# Altium schematic sheet 02_STEPPERS.SchDoc
size A4; SheetNumber: 3; SheetTotal: 3
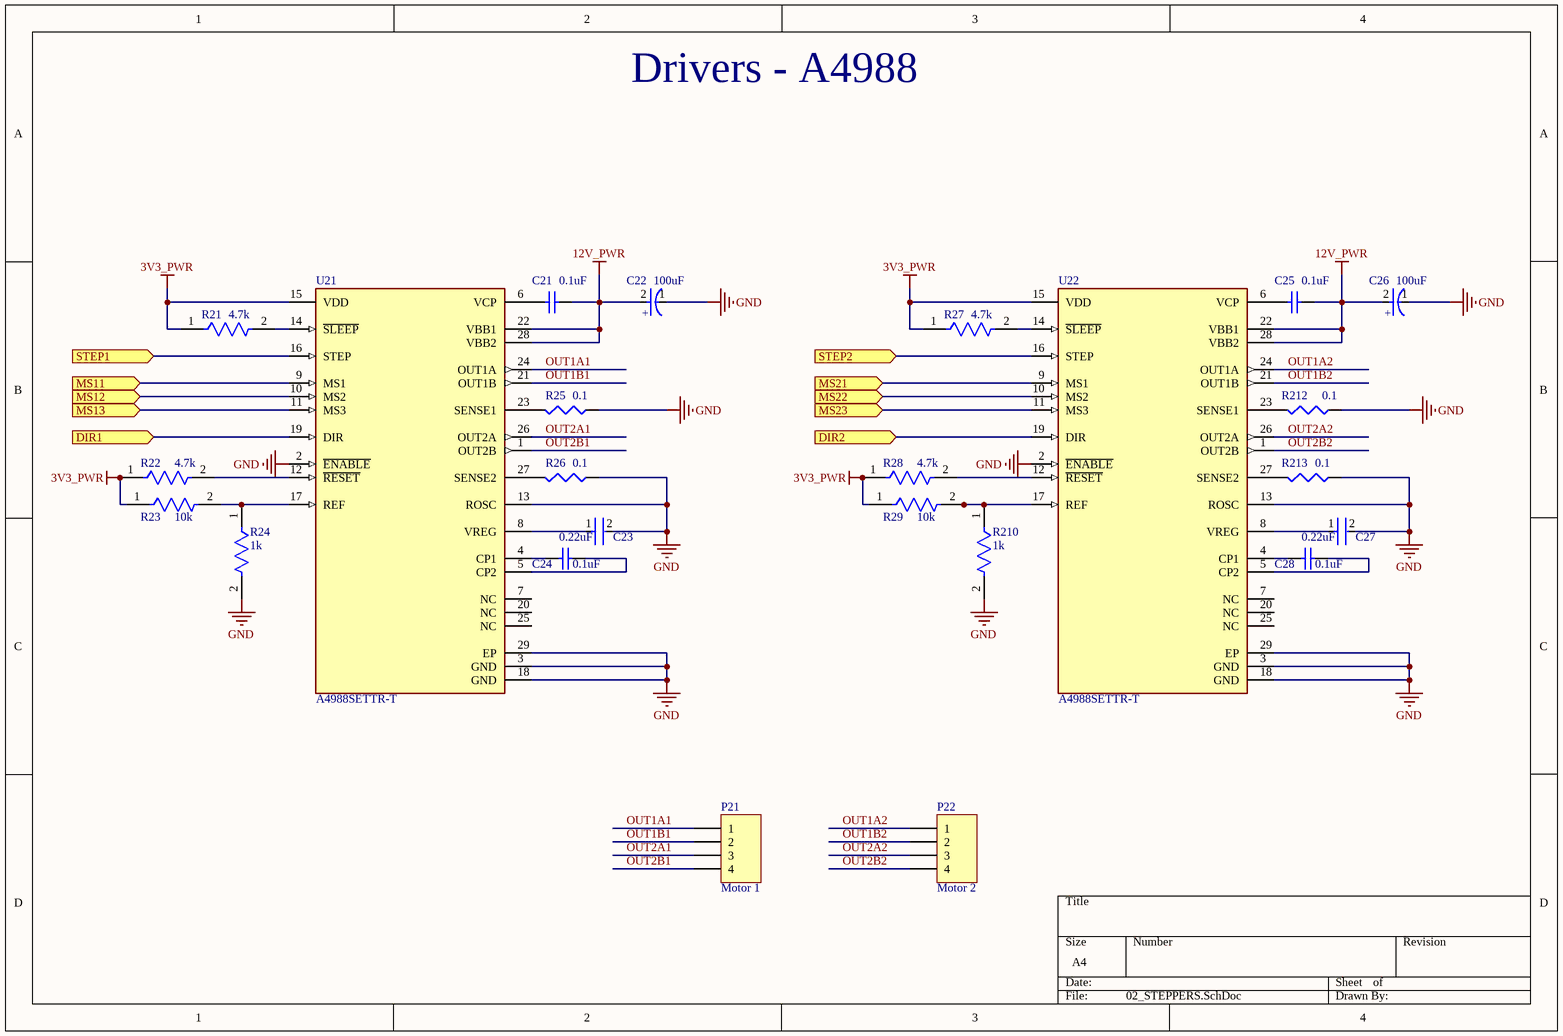
[diagram p0: 02_STEPPERS.SchDoc]

## Parts
C21  0.1uF  [CAPC1608X90X35ML15T15]
C22  100uF  [FP-MAL2150-1010-MFG]
C23  0.22uF  [FP-GCM188-0_1-IPC_B]
C24  0.1uF  [CAPC1608X90X35ML15T15]
C25  0.1uF  [CAPC1608X90X35ML15T15]
C26  100uF  [FP-MAL2150-1010-MFG]
C27  0.22uF  [FP-GCM188-0_1-IPC_B]
C28  0.1uF  [CAPC1608X90X35ML15T15]
P21  Motor 1  [HDR1X4]
P22  Motor 2  [HDR1X4]
R21  4.7k  [FP-MCT0603-IPC_B]
R22  4.7k  [FP-MCT0603-IPC_B]
R23  10k  [FP-AC0603-MFG]
R24  1k  [FP-RC0603-0_55-IPC_C]
R25  value 0.1  [J1-0603]  (hidden comment: Res3)
R26  value 0.1  [J1-0603]  (hidden comment: Res3)
R27  4.7k  [FP-MCT0603-IPC_B]
R28  4.7k  [FP-MCT0603-IPC_B]
R29  10k  [FP-AC0603-MFG]
R210  1k  [FP-RC0603-0_55-IPC_C]
R212  value 0.1  [J1-0603]  (hidden comment: Res3)
R213  value 0.1  [J1-0603]  (hidden comment: Res3)
U21  A4988SETTR-T  [FP-ET-28-MFG]
U22  A4988SETTR-T  [FP-ET-28-MFG]

## Ports
DIR1 (in, see GENERAL_DIAGRAMS[3B], 01_MAIN[1C]), DIR2 (in, see GENERAL_DIAGRAMS[3B], 01_MAIN[1C]), MS11 (in, see GENERAL_DIAGRAMS[3B], 01_MAIN[1C]), MS12 (in, see GENERAL_DIAGRAMS[3B], 01_MAIN[1C]), MS13 (in, see GENERAL_DIAGRAMS[3B], 01_MAIN[1C]), MS21 (in, see GENERAL_DIAGRAMS[3B], 01_MAIN[1C]), MS22 (in, see GENERAL_DIAGRAMS[3B], 01_MAIN[1C]), MS23 (in, see GENERAL_DIAGRAMS[3C], 01_MAIN[1C]), STEP1 (in, see GENERAL_DIAGRAMS[3B], 01_MAIN[1C]), STEP2 (in, see GENERAL_DIAGRAMS[3B], 01_MAIN[1C])

## Nets
3V3_PWR: R21.1 R22.1 R23.1 R27.1 R28.1 R29.1 U21.15(VDD) U22.15(VDD)
12V_PWR: C21.2 C22.2(A) C25.2 C26.2(A) U21.22(VBB1) U21.28(VBB2) U22.22(VBB1) U22.28(VBB2)
GND: C22.1(C) C23.2 C26.1(C) C27.2 R24.2 R25.1 R26.1 R210.2 R212.1 R213.1 U21.2(~{ENABLE}) U21.3(GND) U21.13(ROSC) U21.18(GND) U21.29(EP) U22.2(~{ENABLE}) U22.3(GND) U22.13(ROSC) U22.18(GND) U22.29(EP)
DIR1: U21.19(DIR) ; port DIR1
DIR2: U22.19(DIR) ; port DIR2
MS11: U21.9(MS1) ; port MS11
MS12: U21.10(MS2) ; port MS12
MS13: U21.11(MS3) ; port MS13
MS21: U22.9(MS1) ; port MS21
MS22: U22.10(MS2) ; port MS22
MS23: U22.11(MS3) ; port MS23
OUT1A1: P21.1 U21.24(OUT1A)
OUT1A2: P22.1 U22.24(OUT1A)
OUT1B1: P21.2 U21.21(OUT1B)
OUT1B2: P22.2 U22.21(OUT1B)
OUT2A1: P21.3 U21.26(OUT2A)
OUT2A2: P22.3 U22.26(OUT2A)
OUT2B1: P21.4 U21.1(OUT2B)
OUT2B2: P22.4 U22.1(OUT2B)
STEP1: U21.16(STEP) ; port STEP1
STEP2: U22.16(STEP) ; port STEP2
NetC21_1: C21.1 U21.6(VCP)
NetC23_1: C23.1 U21.8(VREG)
NetC24_1: C24.1 U21.5(CP2)
NetC24_2: C24.2 U21.4(CP1)
NetC25_1: C25.1 U22.6(VCP)
NetC27_1: C27.1 U22.8(VREG)
NetC28_1: C28.1 U22.5(CP2)
NetC28_2: C28.2 U22.4(CP1)
NetR21_2: R21.2 U21.14(~{SLEEP})
NetR22_2: R22.2 U21.12(~{RESET})
NetR23_2: R23.2 R24.1 U21.17(REF)
NetR25_2: R25.2 U21.23(SENSE1)
NetR26_2: R26.2 U21.27(SENSE2)
NetR27_2: R27.2 U22.14(~{SLEEP})
NetR28_2: R28.2 U22.12(~{RESET})
NetR29_2: R29.2 R210.1 U22.17(REF)
NetR212_2: R212.2 U22.23(SENSE1)
NetR213_2: R213.2 U22.27(SENSE2)

Not connected (* = marked no-connect by the designer): U21 7(NC) 20(NC) 25(NC); U22 7(NC) 20(NC) 25(NC)

## Notes on the sheet
- Drivers - A4988
- (in symbol CMP-02412-000026-1) +

## Library data of the parts
C21 C24 C25 C28 = CMP-2006-02075-1: Part Number: 06033C104KAT4A; Manufacturer: AVX Interconnect / Elco; Value: 100nF; Tolerance: 10%; Dielectric: X7R; Voltage Rating: 25V; Supplier: Digi-Key; Supplier Part Number: 478-7018-1-ND; Manufacturer Part Number: 06033C104KAT4A; RoHS: Yes; Category: Ceramic Capacitors; Stock: 1374924; Pricing: 1=0,1, 10=0,039, 50=0,0212, 100=0,0173, 500=0,01238, 1000=0,00972, 2500=0,00884, 5000=0,00813 (USD); Mounting Technology: Surface Mount; Case/Package: 0603; Pins: 2; Case Code (Metric): 1608; Case Code (Imperial): 0603; Min Operating Temperature: -55°C; Max Operating Temperature: 125°C; Packaging: Cut Tape; Series: -; Length: 1.6mm; Depth: 0.81mm; Reach SVHC Compliant: No; Lead Free: Lead Free; RoHS Compliant: Yes; ComponentLink1URL: https://datasheet.ciiva.com/22619/1679506-22619862.pdf?src-supplier=Element14; ComponentLink1Description: https://datasheet.ciiva.com/22619/1679506-22619862.pdf?src-supplier=Element14; ComponentLink2URL: https://datasheet.ciiva.com/28613/1679506-28613035.pdf?src-supplier=Element14; ComponentLink2Description: https://datasheet.ciiva.com/28613/1679506-28613035.pdf?src-supplier=Element14; ComponentLink3URL: https://datasheet.ciiva.com/6277/cx7r-6277758.pdf?src-supplier=Digi-Key; ComponentLink3Description: https://datasheet.ciiva.com/6277/cx7r-6277758.pdf?src-supplier=Digi-Key; ComponentLink4URL: https://datasheet.ciiva.com/6277/cx7r-6277759.pdf?src-supplier=Digi-Key; ComponentLink4Description: https://datasheet.ciiva.com/6277/cx7r-6277759.pdf?src-supplier=Digi-Key
C22 C26 = CMP-02412-000026-1: CAP ALUM 100UF 20% 50V SMD; Manufacturer: Vishay BCcomponents; Manufacturer Part Number: MAL215097101E3; Impedance: 240mR; Dissipation Factor: 0.12%; Ripple Current (AC): 490mA; Dielectric Material: Aluminium; Life (Hours): 3000Hour; Voltage Rating (DC): 50V; Capacitance: 100uF; Voltage Rating: 50V; Max Operating Temperature: 105°C; Width: 10mm; Construction: Cylindrical; ESR (Equivalent Series Resistance): 240mR; Radiation Hardening: No; Length: 10mm; Case/Package: Radial; Packaging: Tape and Reel; Min Operating Temperature: -55°C; Package Quantity: 500; RoHS Compliant: Yes; Series: Automotive, AEC-Q200, 150 CRZ; Ripple Current: 490mA; Height: 10mm; Tolerance: 20%; Diameter: 10mm; Termination: SMD/SMT; Supplier: Digi-Key; Supplier Part Number: BC5165CT-ND; RoHS: Yes; Category: Aluminum Electrolytic Capacitors; Stock: 6366; Pricing: 1=2,21, 10=1,787, 50=1,5594, 100=1,3645 (USD); Value: 100uF; Reach SVHC Compliant: Unknown; ComponentLink1URL: https://datasheet.ciiva.com/22698/1839053-22698438.pdf?src-supplier=Element14; ComponentLink1Description: https://datasheet.ciiva.com/22698/1839053-22698438.pdf?src-supplier=Element14; ComponentLink2URL: https://datasheet.ciiva.com/1455/1839053-1455747.pdf?src-supplier=Element14; ComponentLink2Description: https://datasheet.ciiva.com/1455/1839053-1455747.pdf?src-supplier=Element14
C23 C27 = CMP-06035-005079-1: Ceramic Capacitor for Automotive 220nF  ±10% 25VDC X7R 0603 Paper T/R; Manufacturer: Murata; Manufacturer Part Number: GCM188R71E224KA55J; Voltage Rating (DC): 25V; Lead Free: Lead Free; Case/Package: 0603; Case Code (Imperial): 0603; Radiation Hardening: No; Width: 0.8mm; Termination: SMD/SMT; Mount: Surface Mount; Min Operating Temperature: -55°C; Depth: 0.8mm; Voltage Rating: 25V; Ratings: AEC-Q200; Dielectric: X7R; Thickness: 0.035inch; Height: 0.8mm; Packaging: Tape and Reel; Length: 1.6mm; Case Code (Metric): 1608; Package Quantity: 10000; Tolerance: 10%; Capacitance: 220nF; Max Operating Temperature: 125°C; Supplier: Digi-Key; Supplier Part Number: 490-8017-1-ND; RoHS: Yes; Category: Ceramic Capacitors; Stock: 516546; Pricing: 1=0,11, 10=0,08, 50=0,0436, 100=0,0356, 500=0,02546, 1000=0,02, 2500=0,01818, 5000=0,01673 (USD); Mounting Technology: Surface Mount; Value: 220nF; Series: GCM; Construction: Flat; RoHS Compliant: Yes; ComponentLink1URL: https://datasheet.ciiva.com/29541/product-29541560.pdf?src-supplier=Digi-Key; ComponentLink1Description: https://datasheet.ciiva.com/29541/product-29541560.pdf?src-supplier=Digi-Key; ComponentLink2URL: https://datasheet.ciiva.com/11619/product-11619017.pdf?src-supplier=Avnet; ComponentLink2Description: https://datasheet.ciiva.com/11619/product-11619017.pdf?src-supplier=Avnet; ComponentLink3URL: https://datasheet.ciiva.com/29541/product-29541578.pdf?src-supplier=Digi-Key; ComponentLink3Description: https://datasheet.ciiva.com/29541/product-29541578.pdf?src-supplier=Digi-Key; ComponentLink4URL: https://datasheet.ciiva.com/29541/product-29541579.pdf?src-supplier=Digi-Key; ComponentLink4Description: https://datasheet.ciiva.com/29541/product-29541579.pdf?src-supplier=Digi-Key
P21 P22 = Header 4: Header, 4-Pin; LatestRevisionDate: 17-Jul-2002; LatestRevisionNote: Re-released for DXP Platform.; Publisher: Altium Limited
R21 R22 R27 R28 = CMP-02407-000771-1: RES SMD 100 OHM 1% 1/8W 0603; Manufacturer: Vishay BCcomponents; Manufacturer Part Number: MCT0603MD4701BP500; Temperature Coefficient: 25ppm/°C; Max Power Dissipation: 125mW; Resistance: 4.7kR; Tolerance: 0.1%; Value: 4.7kR; Number of Terminations: 2; Features: Automotive AEC-Q200; Composition: Thin Film; Case/Package: 0603; Min Operating Temperature: -55°C; Packaging: Tape and Reel; Max Operating Temperature: 155°C; Supplier 1: Mouser; RoHS: Yes; Category: Chip SMD Resistors; Stock 1: 4730; Pricing 1: 1=0,65, 10=0,463, 50=0,463, 100=0,238, 1000=0,13, 10000=0,123 (USD); Series: MCT AT - Precision; RoHS Compliant: Yes; ComponentLink1URL: http://www.vishay.com/docs/28785/mcat_pre.pdf?src-supplier=Digi-Key; ComponentLink1Description: http://www.vishay.com/docs/28785/mcat_pre.pdf?src-supplier=Digi-Key
R23 R29 = CMP-2000-04818-3: RES 10KΩ 1.00% 0.1W 0603; Manufacturer: Yageo; Manufacturer Part Number: AC0603FR-0710KL; Power Rating: 100mW; Tolerance: 1%; Resistance: 10kR; Voltage Rating: 50V; Temperature Coefficient: 100ppm/°C; Value: 10kR; Ratings: AEC-Q200; Case Code (Metric): 1608; Max Power Dissipation: 100mW; Height: 0.45mm; Package Quantity: 1; Max Operating Temperature: 155°C; Resistor Type: Thick Film; Depth: 0.8mm; RoHS Compliant: Yes; Min Operating Temperature: -55°C; Packaging: Tape and Reel; Number of Terminations: 2; Length: 1.6mm; Features: Moisture Resistant; Military Standard: Not; Case Code (Imperial): 0603; Size Code: 0603; Termination: SMD/SMT; Case/Package: 0603; Mount: Surface Mount; Width: 0.8mm; Lead Free: Lead Free; Series: AC; Construction: Rectangular; Supplier 1: Mouser; RoHS: Yes; Category: Chip SMD Resistors; Stock 1: 1450617; Pricing 1: 1=0,1, 10=0,003, 50=0,003, 100=0,003, 1000=0,003, 10000=0,002 (USD); Mounting Technology: Surface Mount; ComponentLink1URL: https://datasheet.ciiva.com/26862/getdatasheetpartid-724997-26862461.pdf?src-supplier=Verical; ComponentLink1Description: https://datasheet.ciiva.com/26862/getdatasheetpartid-724997-26862461.pdf?src-supplier=Verical
R24 R210 = CMP-1659-00009-5: RES 1K OHM 1% 1/10W 0603; Manufacturer: Yageo; Manufacturer Part Number: RC0603FR-071KL; Resistance: 1kR; Voltage Rating: 50V; Power Rating: 100mW; Temperature Coefficient: 100ppm/°C; Value: 1kR; Military Standard: Not; REACH SVHC: No SVHC; Size Code: 0603; Features: Moisture Resistant; Number of Terminations: 2; Technology: THICK FILM; Series: RC; Case Code (Metric): 1608; Resistance Tolerance: 1%; Resistor Type: Thick Film; Termination: SMD/SMT; Contact Plating: Tin; Radiation Hardening: No; Min Operating Temperature: -55°C; Max Operating Temperature: 155°C; Packaging: Tape and Reel; Max Power Dissipation: 100mW; RoHS Compliant: Yes; Height: 0.45mm; Lead Free: Lead Free; Case/Package: 0603; Length: 1.6mm; Tolerance: 1%; Case Code (Imperial): 0603; Construction: Rectangular; Depth: 0.8mm; Supplier 1: Mouser; RoHS: Yes; Category: Chip SMD Resistors; Stock 1: 9884296; Pricing 1: 1=0,1, 10=0,019, 50=0,019, 100=0,007, 1000=0,004, 10000=0,002 (USD); Reach SVHC Compliant: No
R25 R26 R212 R213 = Res3: Thick Film Surface Mount Chip Resistor 0603 Size 0.1 Ohm 5% 0.1 W ±400 ppm/°C 2-Pin SMD T/R; Manufacturer: Vishay Dale; Manufacturer Part Number: RCWL0603R100JQEA; Max Power Dissipation: 100mW; Published: 8-Jun-2000; LatestRevisionDate: 29-May-2009; LatestRevisionNote: IPC-7351 Footprint Added.; PackageReference: J1-0603; Publisher: Altium Limited; PackageDescription: Chip Resistor; Supplier 1: Mouser; RoHS: Yes; Category: Chip SMD Resistors; Stock 1: 12117; Pricing 1: 1=0,35, 10=0,303, 50=0,303, 100=0,119, 1000=0,05, 10000=0,038 (USD); Case/Package: 0603; Min Operating Temperature: -55°C; Max Operating Temperature: 155°C; Packaging: Tape and Reel; Number of Terminations: 2; Tolerance: 5%; Temperature Coefficient: 400ppm/°C; Features: Moisture Resistant,Automotive AEC-Q200; Series: RCWL; Length: 0.061inch; Width: 0.033inch; Height: 0.02inch; RoHS Compliant: Yes; ComponentLink1URL: http://www.vishay.com/docs/20018/rcwl.pdf?src-supplier=Digi-Key; ComponentLink1Description: http://www.vishay.com/docs/20018/rcwl.pdf?src-supplier=Digi-Key
U21 U22 = CMP-1742-00003-2: IC MTR DRVR BIPOLAR 3-5.5V 28QFN; Manufacturer: Allegro MicroSystems; Number of Outputs: 1; Motor Type: Stepper; Output Current: 2A; Min Supply Voltage: 8V; Output Voltage: 35V; Interface: Logic; Package Quantity: 1; Max Operating Temperature: 85°C; Case/Package: QFN EP; Mount: Surface Mount; Packaging: Tape and Reel; Radiation Hardening: No; REACH SVHC: No SVHC; Min Operating Temperature: -20°C; Max Supply Voltage: 35V; Number of Pins: 28; Supplier: Digi-Key; Supplier Part Number: 620-1343-1-ND; Manufacturer Part Number: A4988SETTR-T; RoHS: Yes; Category: Motor Drivers; Stock: 345; Pricing: 1=3,11, 10=2,795, 25=2,642, 100=2,2897, 250=2,17228, 500=1,94918 (USD); Mounting Technology: Surface Mount; Pins: 28; Series: -; Technology: DMOS; Reach SVHC Compliant: No; RoHS Compliant: Yes; ComponentLink1URL: https://datasheet.ciiva.com/1147/1481258-1147170.pdf?src-supplier=Element14; ComponentLink1Description: https://datasheet.ciiva.com/1147/1481258-1147170.pdf?src-supplier=Element14; ComponentLink2URL: https://datasheet.ciiva.com/1608/a4988-datasheet-1608449.pdf?src-supplier=Newark; ComponentLink2Description: https://datasheet.ciiva.com/1608/a4988-datasheet-1608449.pdf?src-supplier=Newark; ComponentLink3URL: https://datasheet.ciiva.com/15109/getdatasheetpartid-557828-15109654.pdf?src-supplier=Verical; ComponentLink3Description: https://datasheet.ciiva.com/15109/getdatasheetpartid-557828-15109654.pdf?src-supplier=Verical; ComponentLink4URL: https://datasheet.ciiva.com/3229/a4988-datasheet-3229532.pdf?src-supplier=Avnet; ComponentLink4Description: https://datasheet.ciiva.com/3229/a4988-datasheet-3229532.pdf?src-supplier=Avnet